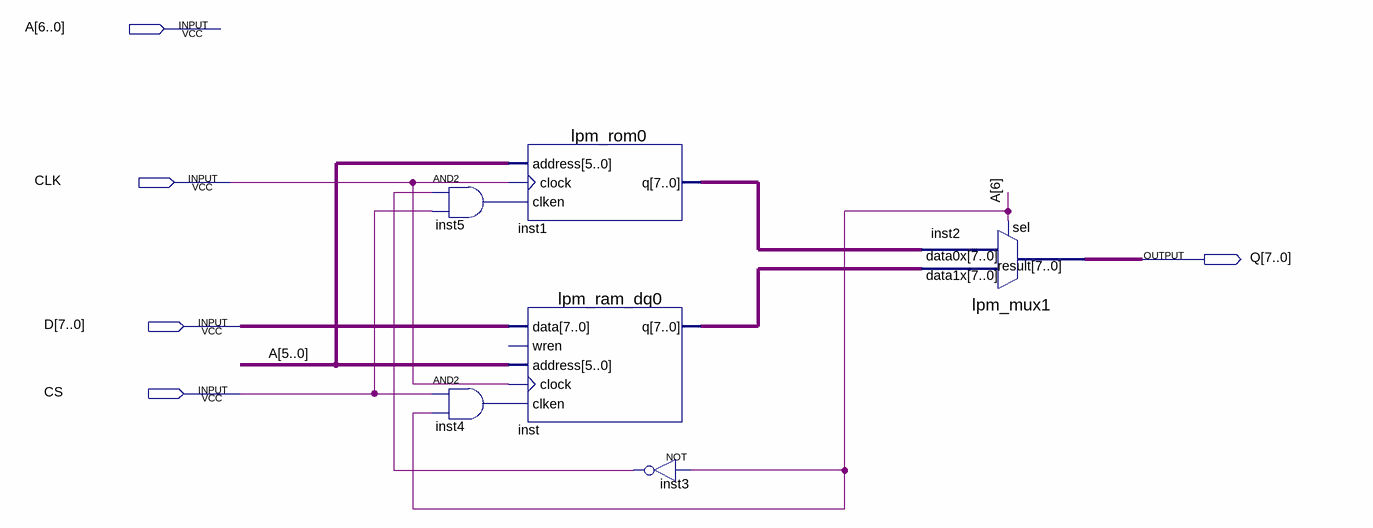
[diagram p0: schematic sheet]
// Quartus schematic MEM.bdf as structural Verilog: 6 symbols, 5 pins
module MEM (
  input  [6:0] A,
  input  CLK,
  input  [7:0] D,
  input  CS,
  output [7:0] Q
);

  wire inst3_out, inst4_out, inst5_out;
  wire [7:0] inst1_q, inst_q;

  and inst5 (inst5_out, inst3_out, CS);
  and inst4 (inst4_out, CS, A[6]);
  lpm_rom0 inst1 (.address(A[5:0]), .clock(CLK), .clken(inst5_out), .q(inst1_q));
  lpm_ram_dq0 inst (.data(D), .address(A[5:0]), .clock(CLK), .clken(inst4_out), .q(inst_q));  // open: wren
  not inst3 (inst3_out, A[6]);
  lpm_mux1 inst2 (.data1x(inst_q), .data0x(inst1_q), .sel(A[6]), .result(Q));
endmodule
